# EAGLE design Fritzen_Zero_P_r00 (EAGLE 7.5.0)

## Sheet 1 of 2
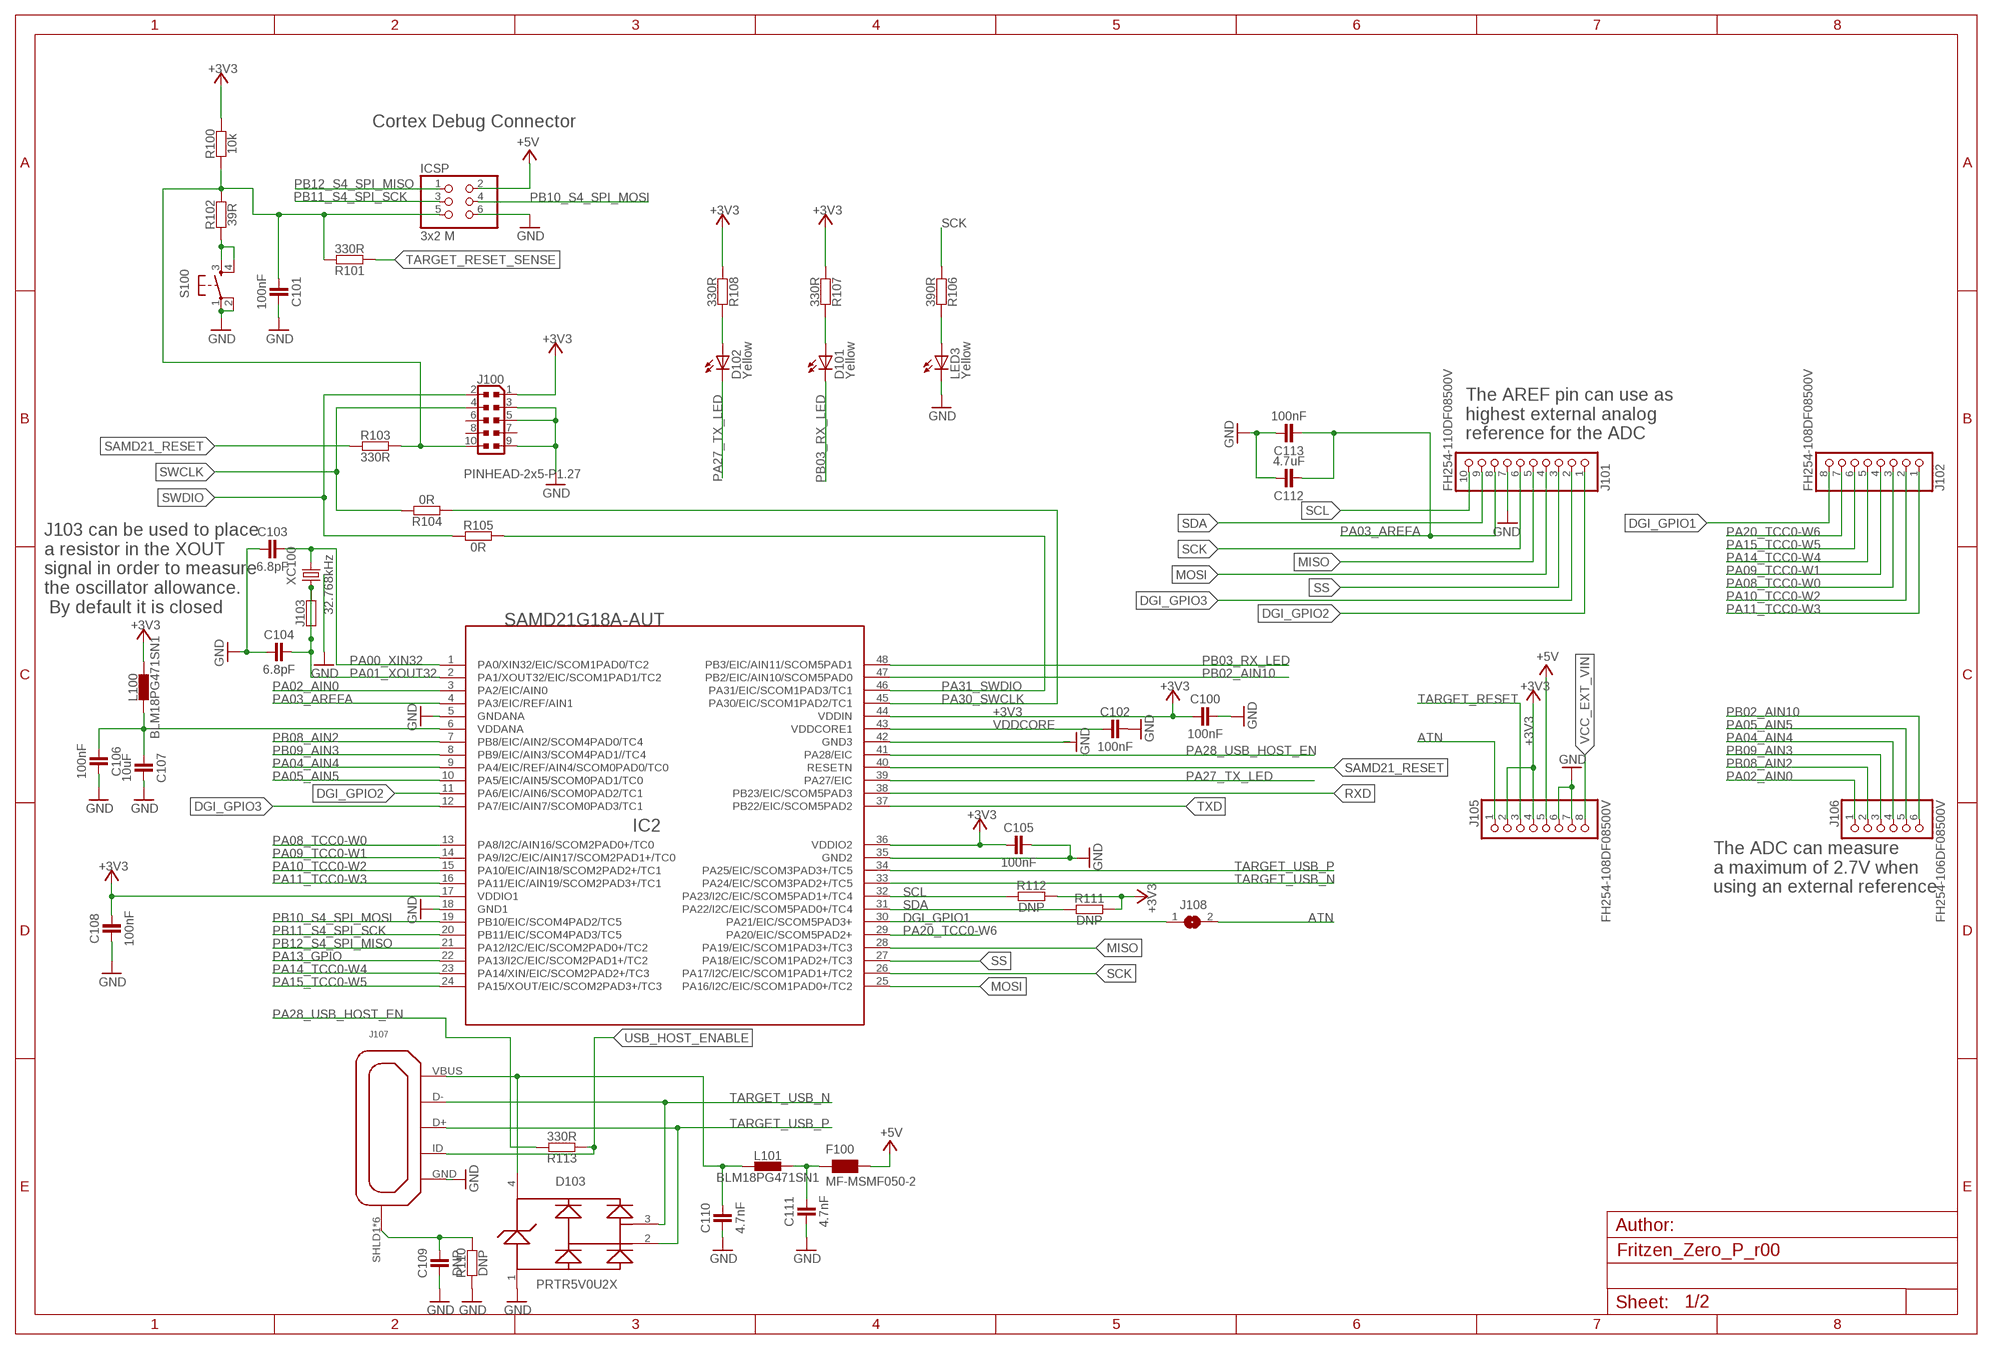
[diagram p0: schematic, sheet 1]

### Parts
C100  100nF  CAPACITORS-0402  [C0402]
C101  100nF  CAPACITORS-0402  [C0402]
C102  100nF  CAPACITORS-0402  [C0402]
C103  6.8pF  CAPACITORS-0402  [C0402]
C104  6.8pF  CAPACITORS-0402  [C0402]
C105  100nF  CAPACITORS-0402  [C0402]
C106  100nF  CAPACITORS-0402  [C0402]
C107  10uF  CAPACITORS-0603  [C0603]
C108  100nF  CAPACITORS-0402  [C0402]
C109  DNP  CAPACITORS-0402  [C0402]
C110  4.7nF  CAPACITORS-0402  [C0402]
C111  4.7nF  CAPACITORS-0402  [C0402]
C112  4.7uF  CAPACITORS-0603  [C0603]
C113  100nF  CAPACITORS-0402  [C0402]
D101  Yellow  0044_KPT-2012YC  [CHIPLED_0805]
D102  Yellow  0044_KPT-2012YC  [CHIPLED_0805]
D103  PRTR5V0U2XB  [SOT143B]
F100  MF-MSMF050-2  WUERTH-ELEKTRONIK_WE-CBF_1812  [WUERTH-ELEKTRONIK_1812]
IC2  SAMD21G18A-AUT  SAMD21G18A  [TQFP48]
ICSP  3x2 M  ICSP  [2X03]
J100  PINHEAD-2x5-P1.27  0171_PH127-205DF055G00AROUND-PADS  [PINHEAD_2X05_127]
J101  FH254-110DF08500V  1684_20TW-537  [1X10]
J102  FH254-108DF08500V  1683_20TW-536  [1X08]
J103  RESISTORS-0402  [C0402]
J105  FH254-108DF08500V  1683_20TW-536  [1X08]
J106  FH254-106DF08500V  1682_20TW-535_STD  [1X06]
J107  ZX62-AB-5PA  [USB-MICRO-10103594]
J108  SJ  [SJ]
L100  BLM18PG471SN1  INDUCTOR-0603  [C0603]
L101  BLM18PG471SN1  INDUCTOR-0603  [C0603]
LED3  Yellow  0044_KPT-2012YC  [CHIPLED_0805]
R100  10k  RESISTORS-0402  [C0402]
R101  330R  RESISTORS-0402  [C0402]
R102  39R  RESISTORS-0402  [C0402]
R103  330R  RESISTORS-0402  [C0402]
R104  0R  RESISTORS-0402  [C0402]
R105  0R  RESISTORS-0402  [C0402]
R106  390R  RESISTORS-0402  [C0402]
R107  330R  RESISTORS-0402  [C0402]
R108  330R  RESISTORS-0402  [C0402]
R110  DNP  RESISTORS-0402  [C0402]
R111  DNP  RESISTORS-0402  [C0402]
R112  DNP  RESISTORS-0402  [C0402]
R113  330R  RESISTORS-0402  [C0402]
S100  PUSHBUTTON3  [TS42_4PINS]
XC100  32.768kHz  CRYSTALSMD  [CRYSTAL_TC26SMD]

### Nets
+3V3: C100.1 C105.1 C108.2 IC2.17(VDDIO1) IC2.36(VDDIO2) IC2.44(VDDIN) J100.1 J105.2 J105.4 L100.2 R100.2 R107.1 R108.1 R111.2 R112.2 ; also sheet 2
+5V [usbvcc]: F100.2 ICSP.2 J105.5 ; also sheet 2
ATN: J105.1 J108.2
DGI_GPIO1: IC2.30(PA21/EIC/SCOM5PAD3+) J102.8 J108.1
DGI_GPIO2: IC2.11(PA6/EIC/AIN6/SCOM0PAD2/TC1) J101.1
DGI_GPIO3: IC2.12(PA7/EIC/AIN7/SCOM0PAD3/TC1) J101.2
GND [gnd]: C100.2 C101.2 C102.2 C103.1 C104.1 C105.2 C106.2 C107.2 C108.1 C109.1 C110.1 C111.1 C112.2 C113.2 D103.1 IC2.5(GNDANA) IC2.18(GND1) IC2.35(GND2) IC2.42(GND3) ICSP.6 J100.3 J100.5 J100.9 J101.7 J105.6 J105.7 J107.GND LED3.C R110.1 S100.1 S100.2 XC100.P$1(GND) ; also sheet 2
MISO: IC2.28(PA19/EIC/SCOM1PAD3+/TC3) J101.5
MOSI: IC2.25(PA16/I2C/EIC/SCOM1PAD0+/TC2) J101.4
N$4: R102.1 S100.3 S100.4
N$7: C110.2 D103.4 J107.VBUS(VUSB) L101.1
N$10: C106.1 C107.1 IC2.6(VDDANA) L100.1
N$11: C109.2 J107.SHLD1(SH) J107.SHLD2(SH) J107.SHLD3(SH) J107.SHLD4(SH) J107.SHLD5(SH) J107.SHLD6(SH) R110.2
N$12: C111.2 F100.1 L101.2
N$20: D102.A R108.2
N$21: D101.A R107.2
N$22: LED3.A R106.2
PA00_XIN32: C103.2 IC2.1(PA0/XIN32/EIC/SCOM1PAD0/TC2) XC100.2
PA01_XOUT32: C104.2 IC2.2(PA1/XOUT32/EIC/SCOM1PAD1/TC2) J103.1 J103.2 XC100.1
PA02_AIN0: IC2.3(PA2/EIC/AIN0) J106.1
PA03_AREFA: C112.1 C113.1 IC2.4(PA3/EIC/REF/AIN1) J101.8
PA04_AIN4: IC2.9(PA4/EIC/REF/AIN4/SCOM0PAD0/TC0) J106.4
PA05_AIN5: IC2.10(PA5/EIC/AIN5/SCOM0PAD1/TC0) J106.5
PA08_TCC0-W0: IC2.13(PA8/I2C/AIN16/SCOM2PAD0+/TC0) J102.3
PA09_TCC0-W1: IC2.14(PA9/I2C/EIC/AIN17/SCOM2PAD1+/TC0) J102.4
PA10_TCC0-W2: IC2.15(PA10/EIC/AIN18/SCOM2PAD2+/TC1) J102.2
PA11_TCC0-W3: IC2.16(PA11/EIC/AIN19/SCOM2PAD3+/TC1) J102.1
PA13_GPIO: IC2.22(PA13/I2C/EIC/SCOM2PAD1+/TC2)
PA14_TCC0-W4: IC2.23(PA14/XIN/EIC/SCOM2PAD2+/TC3) J102.5
PA15_TCC0-W5: IC2.24(PA15/XOUT/EIC/SCOM2PAD3+/TC3) J102.6
PA20_TCC0-W6: IC2.29(PA20/EIC/SCOM5PAD2+) J102.7
PA27_TX_LED: D102.C IC2.39(PA27/EIC)
PA28_USB_HOST_EN: IC2.41(PA28/EIC) R113.2
PA30_SWCLK: IC2.45(PA30/EIC/SCOM1PAD2/TC1) R104.1
PA31_SWDIO: IC2.46(PA31/EIC/SCOM1PAD3/TC1) R105.2
PB02_AIN10: IC2.47(PB2/EIC/AIN10/SCOM5PAD0) J106.6
PB03_RX_LED: D101.C IC2.48(PB3/EIC/AIN11/SCOM5PAD1)
PB08_AIN2: IC2.7(PB8/EIC/AIN2/SCOM4PAD0/TC4) J106.2
PB09_AIN3: IC2.8(PB9/EIC/AIN3/SCOM4PAD1//TC4) J106.3
PB10_S4_SPI_MOSI: IC2.19(PB10/EIC/SCOM4PAD2/TC5) ICSP.4
PB11_S4_SPI_SCK: IC2.20(PB11/EIC/SCOM4PAD3/TC5) ICSP.3
PB12_S4_SPI_MISO: IC2.21(PA12/I2C/EIC/SCOM2PAD0+/TC2) ICSP.1
RXD: IC2.38(PB23/EIC/SCOM5PAD3)
SAMD21_RESET: IC2.40(RESETN) R103.1
SCK: IC2.26(PA17/I2C/EIC/SCOM1PAD1+/TC2) J101.6 R106.1
SCL: IC2.32(PA23/I2C/EIC/SCOM5PAD1+/TC4) J101.10 R112.1
SDA: IC2.31(PA22/I2C/EIC/SCOM5PAD0+/TC4) J101.9 R111.1
SS: IC2.27(PA18/EIC/SCOM1PAD2+/TC3) J101.3
SWCLK: J100.4 R104.2
SWDIO: J100.2 R105.1
TARGET_RESET: C101.1 ICSP.5 J100.10 J105.3 R100.1 R101.2 R102.2 R103.2
TARGET_RESET_SENSE: R101.1
TARGET_USB_N [USBpair]: D103.3 IC2.33(PA24/EIC/SCOM3PAD2+/TC5) J107.D-
TARGET_USB_P [USBpair]: D103.2 IC2.34(PA25/EIC/SCOM3PAD3+/TC5) J107.D+
TXD: IC2.37(PB22/EIC/SCOM5PAD2)
USB_HOST_ENABLE: J107.ID R113.1
VCC_EXT_VIN [USB]: J105.8 ; also sheet 2
VDDCORE: C102.1 IC2.43(VDDCORE1)
Unconnected: J100.6 J100.7 J100.8

### Notes on the sheet
- Cortex Debug Connector
- The AREF pin can use as
  highest external analog
  reference for the ADC
- J103 can be used to place
  a resistor in the XOUT 
  signal in order to measure 
  the oscillator allowance.
   By default it is closed
- The ADC can measure 
  a maximum of 2.7V when
  using an external reference

## Sheet 2 of 2
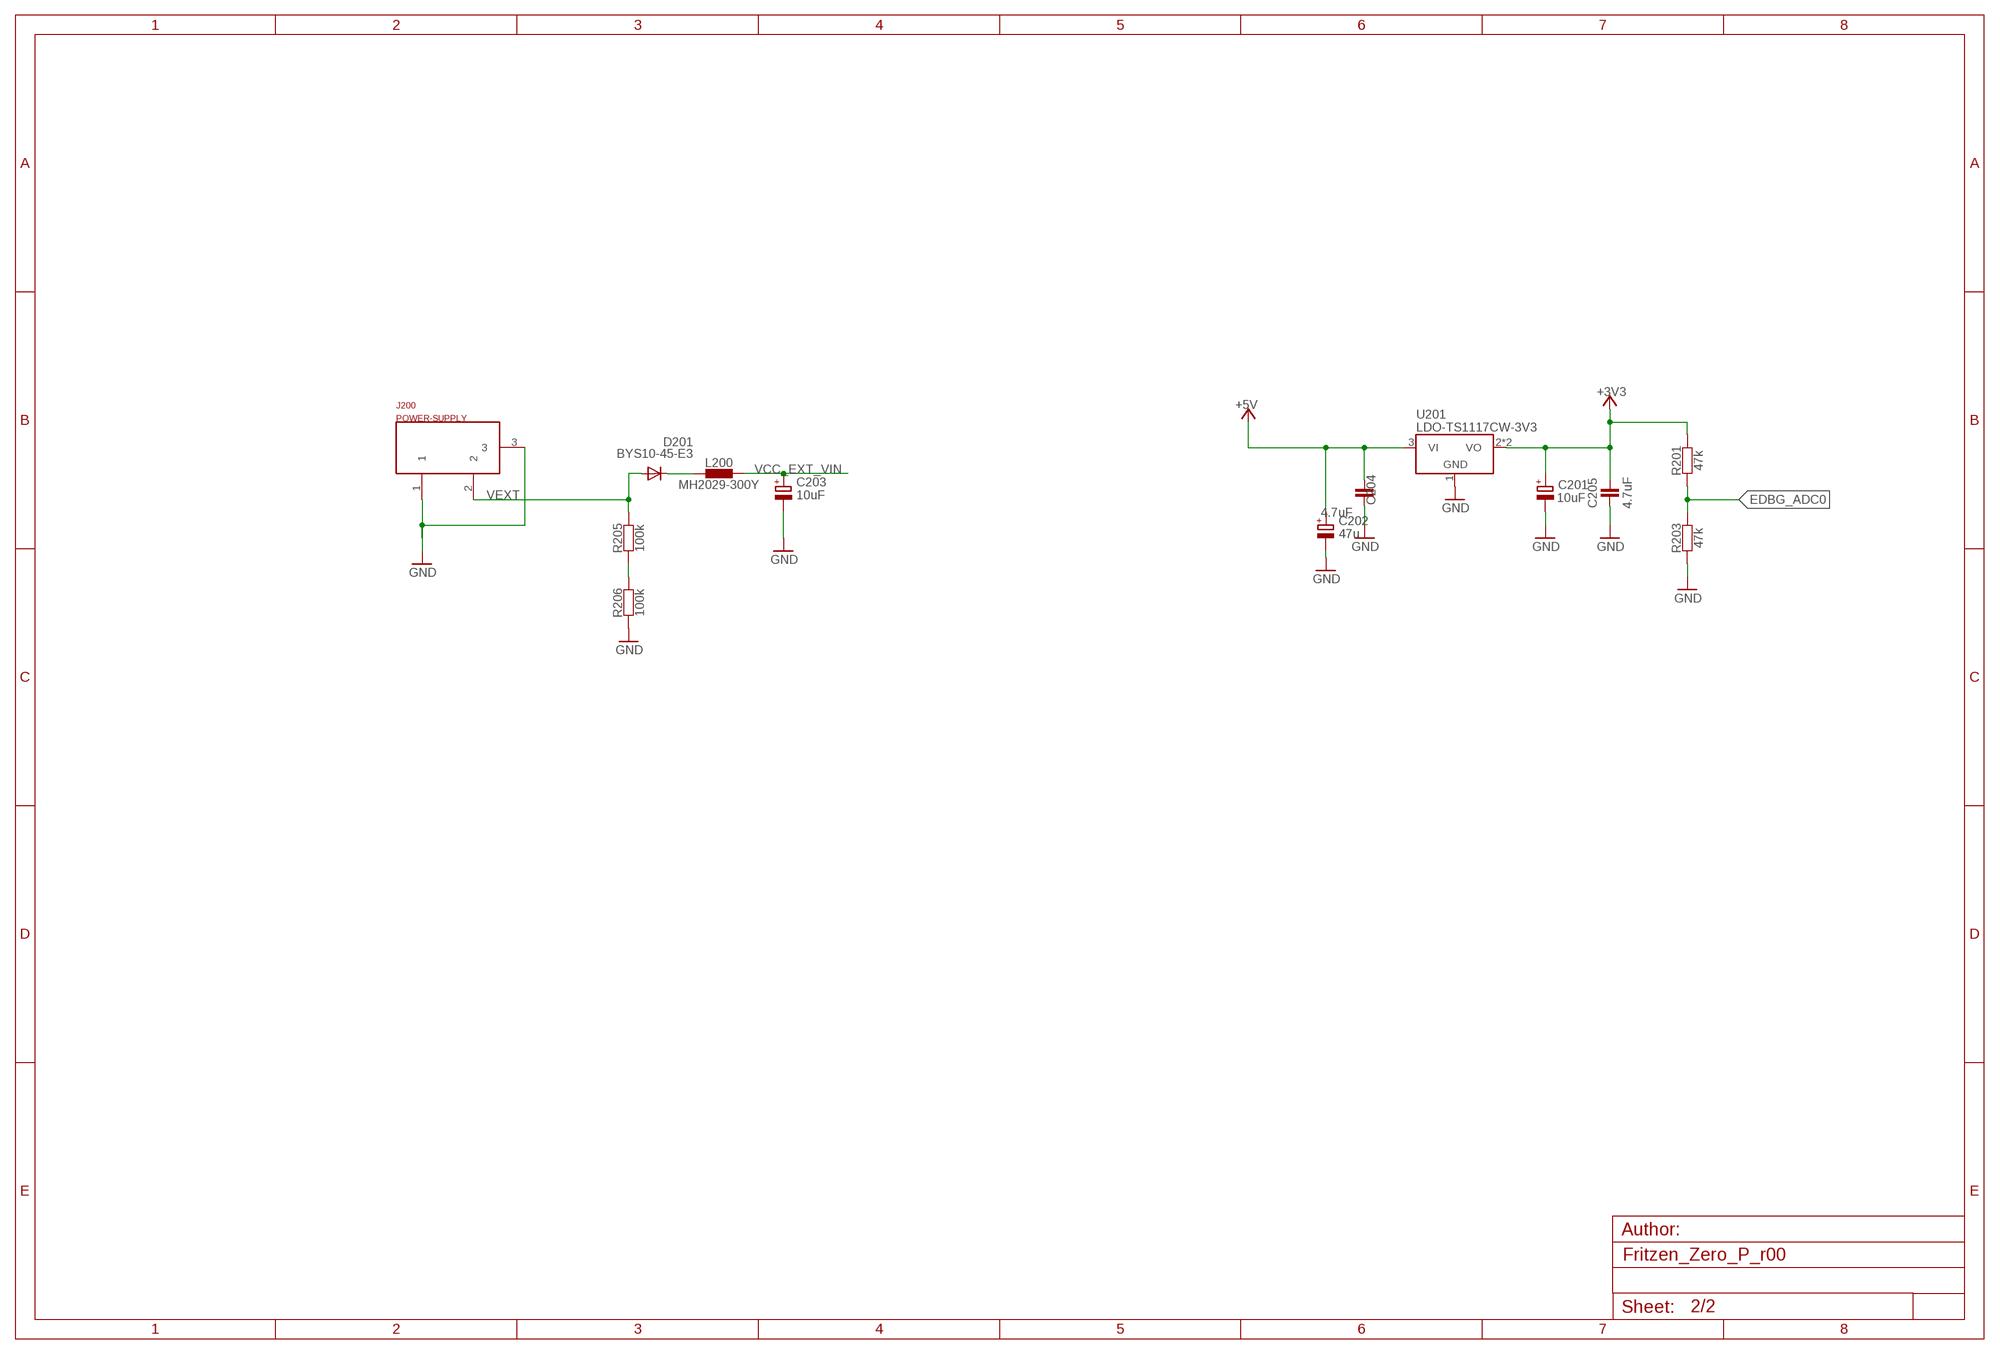
[diagram p1: schematic, sheet 2]

### Parts
C201  10uF  0113_47UF  [PANASONIC_D]
C202  47u  0113_47UF  [PANASONIC_D]
C203  10uF  0113_47UF  [PANASONIC_D]
C204  4.7uF  CAPACITORS-0603  [C0603]
C205  4.7uF  CAPACITORS-0603  [C0603]
D201  BYS10-45-E3  0012_CD1206-S01575  [MINIMELF]
J200  POWER-SUPPLY  0018_19746-POWER-SUPPLY  [POWERSUPPLY_DC-21MM]
L200  MH2029-300Y  INDUCTOR-0805  [C0805]
R201  47k  RESISTORS-0402  [C0402]
R203  47k  RESISTORS-0402  [C0402]
R205  100k  RESISTORS-0402  [C0402]
R206  100k  RESISTORS-0402  [C0402]
U201  LDO-TS1117CW-3V3  [SOT223]

### Nets
+3V3: C201.+ C205.2 R201.2 U201.2(VO) U201.4(VO) ; also sheet 1
+5V [usbvcc]: C202.+ C204.1 U201.3(VI) ; also sheet 1
EDBG_ADC0: R201.1 R203.2
GND [gnd]: C201.- C202.- C203.- C204.2 C205.1 J200.1 J200.3 R203.1 R206.1 U201.1(GND) ; also sheet 1
N$8: D201.C L200.1
VCC_EXT_VIN [USB]: C203.+ L200.2 ; also sheet 1
VEXT [USB]: D201.A J200.2 R205.2
VIN_DETECT: R205.1 R206.2

## Library data of the parts
C100-C113 C204 C205 = Arduino:CAPACITORS: Capacitors ...4.7uF @ 6.3V -> 0402 ...10uF @ 16V -> 0603 ...22uF @ 25V -> 0805
C201-C203 = Condensatori:0113_47UF: 47uF; MONTHLY_USAGE: _____; PART_NUMBER: 47uF; PRICE: _____; SUPPLIER: _____; TYPE: Condensatori; VALUE: 47uF
D101 D102 LED3 = Opto:0044_KPT-2012YC: LED YELLOW - SMD - 0805; MONTHLY_USAGE: _____; PART_NUMBER: KPT-2012YC; PRICE: _____; SUPPLIER: _____; TYPE: Opto
D103 = Arduino:PRTR5V0U2X
D201 = Diodi:0012_CD1206-S01575: small-signal high-speed Switching Diodes CD1206; CASE: 1206; MONTHLY_USAGE: _____; PART_NUMBER: CD1206-S01575; PRICE: _____; SUPPLIER: _____; TYPE: Diodi; VALUE: CD1206-S01575
F100 = Arduino:WUERTH-ELEKTRONIK_WE-CBF: SMD EMI Suppression Ferrite Beads - excellent anti-EMI properties - low DCR - impedances till 3000 ohms - rated current up to 6 A
IC2 = Arduino:SAMD21G18A: Atmel D21 32bit ARM Cortex-M0 microcontroller - 48 PIN TQFP 256KB flash memory + 32KB SRAM
ICSP = Arduino:ICSP: PIN HEADER
J100 = Connettori:0171_PH127-205DF055G00A: 2x5 PASSO 1,27
J101 = Connettori:1684_20TW-537: Female Gray Connector strip for Arduino 3V3 bases - 10x1 F V h 8,5 p2,54mm; MONTHLY_USAGE: _____; PART_NUMBER: 20TW-537; PRICE: _____; SUPPLIER: _____; TYPE: Connettori
J102 J105 = Connettori:1683_20TW-536: Female Gray Connector strip for Arduino 3V3 bases - 8x1 F V h 8,5 p2,54mm; MONTHLY_USAGE: _____; PART_NUMBER: 20TW-536; PRICE: _____; SUPPLIER: _____; TYPE: Connettori
J103 R100-R108 R110-R113 R201 R203 R205 R206 = Arduino:RESISTORS: Resistors all kinds in 0603 and 0402
J106 = Connettori:1682_20TW-535: Female Gray Connector strip for Arduino 3V3 bases - 6x1 F V h 8,5 p2,54; MONTHLY_USAGE: 86722.85; PART_NUMBER: 20TW-535; PRICE: _0.03; SUPPLIER: CBC_elettronica__s.r.l.; TYPE: Connettori
J107 = Arduino:ZX62-AB-5PA
J108 = jumper:SJ: SMD solder JUMPER
J200 = Connettori:0018_19746-POWER-SUPPLY: JACK; MONTHLY_USAGE: _____; PART_NUMBER: 19746; PRICE: _____; SUPPLIER: _____; TYPE: Connettori
L100 L101 L200 = Arduino:INDUCTOR: Inductors
S100 = Arduino:PUSHBUTTON3: TS42 Dongnan Electronics Tact switch VDC 12V - 50mA
U201 = we-power:LDO: LDOs TS1117 800mA max 15V - compatible NCP1117 1A max 20V TS9011 250mA max 12V - compatible AP2210 300mA max 15V TS5204 150mA max 16V
XC100 = Arduino:CRYSTAL: Crystals

## Net classes
0 default: width 0.102 mm, drill 0.1 mm
1 USB: width 0.102 mm, drill 0.1 mm
2 gnd: width 0.102 mm, drill 0.1 mm
3 usbvcc: width 0.102 mm, drill 0.1 mm, clearance 0.15 mm
4 USBpair: width 0.102 mm, drill 0.1 mm, clearance 0.15 mm to class 3

## Board
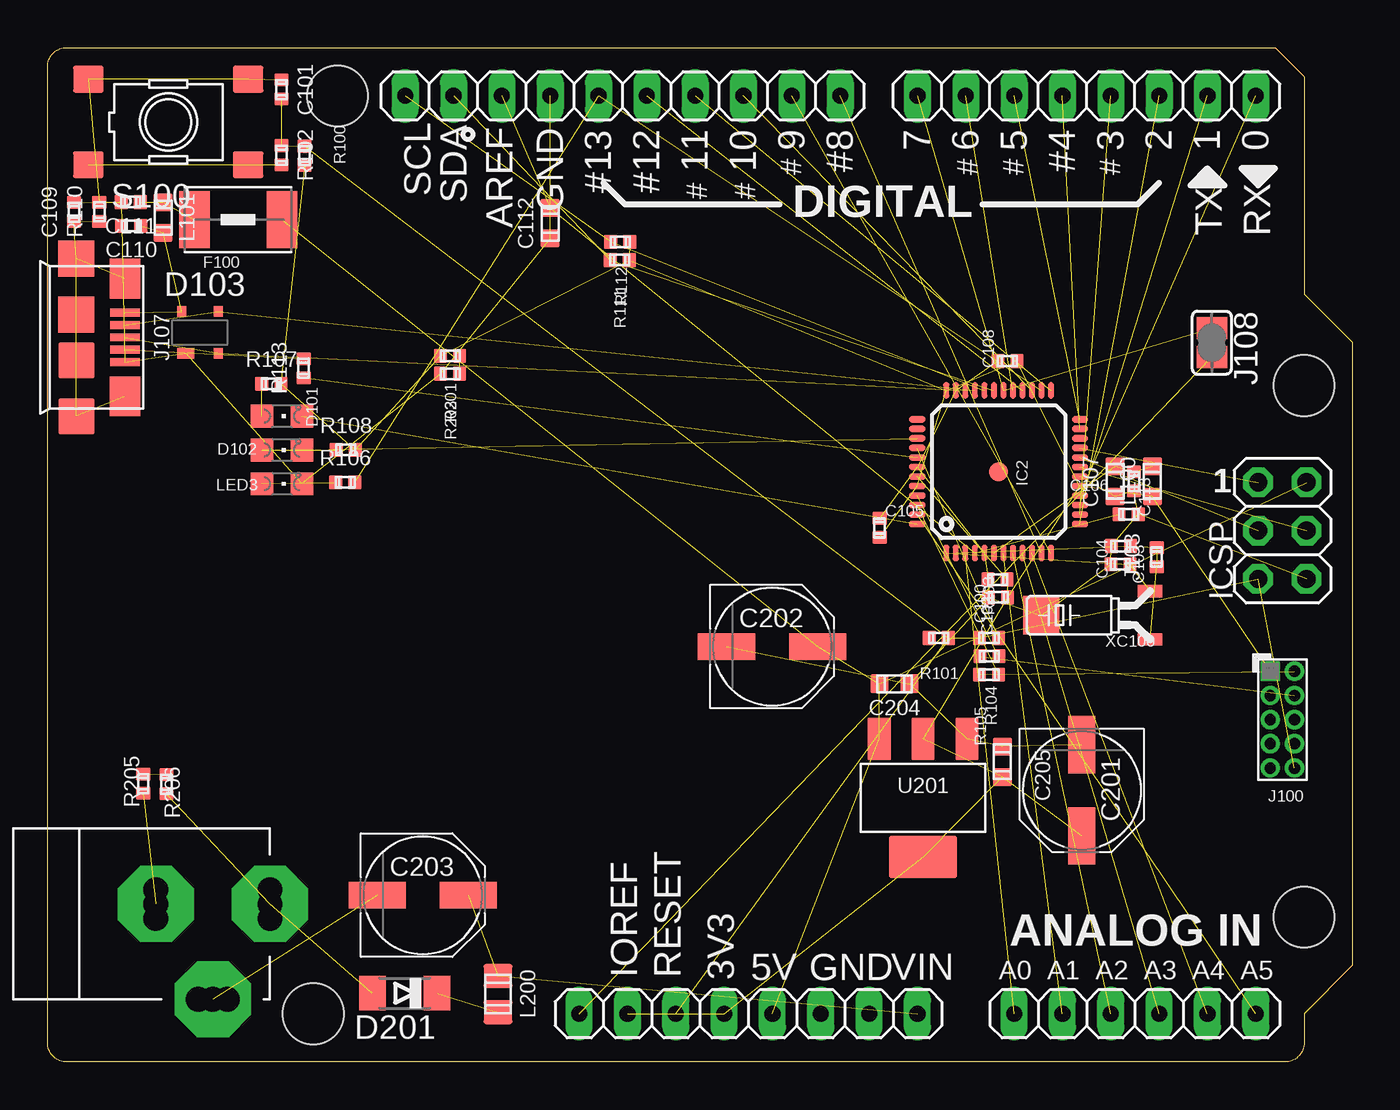
[diagram p2: board, top side]
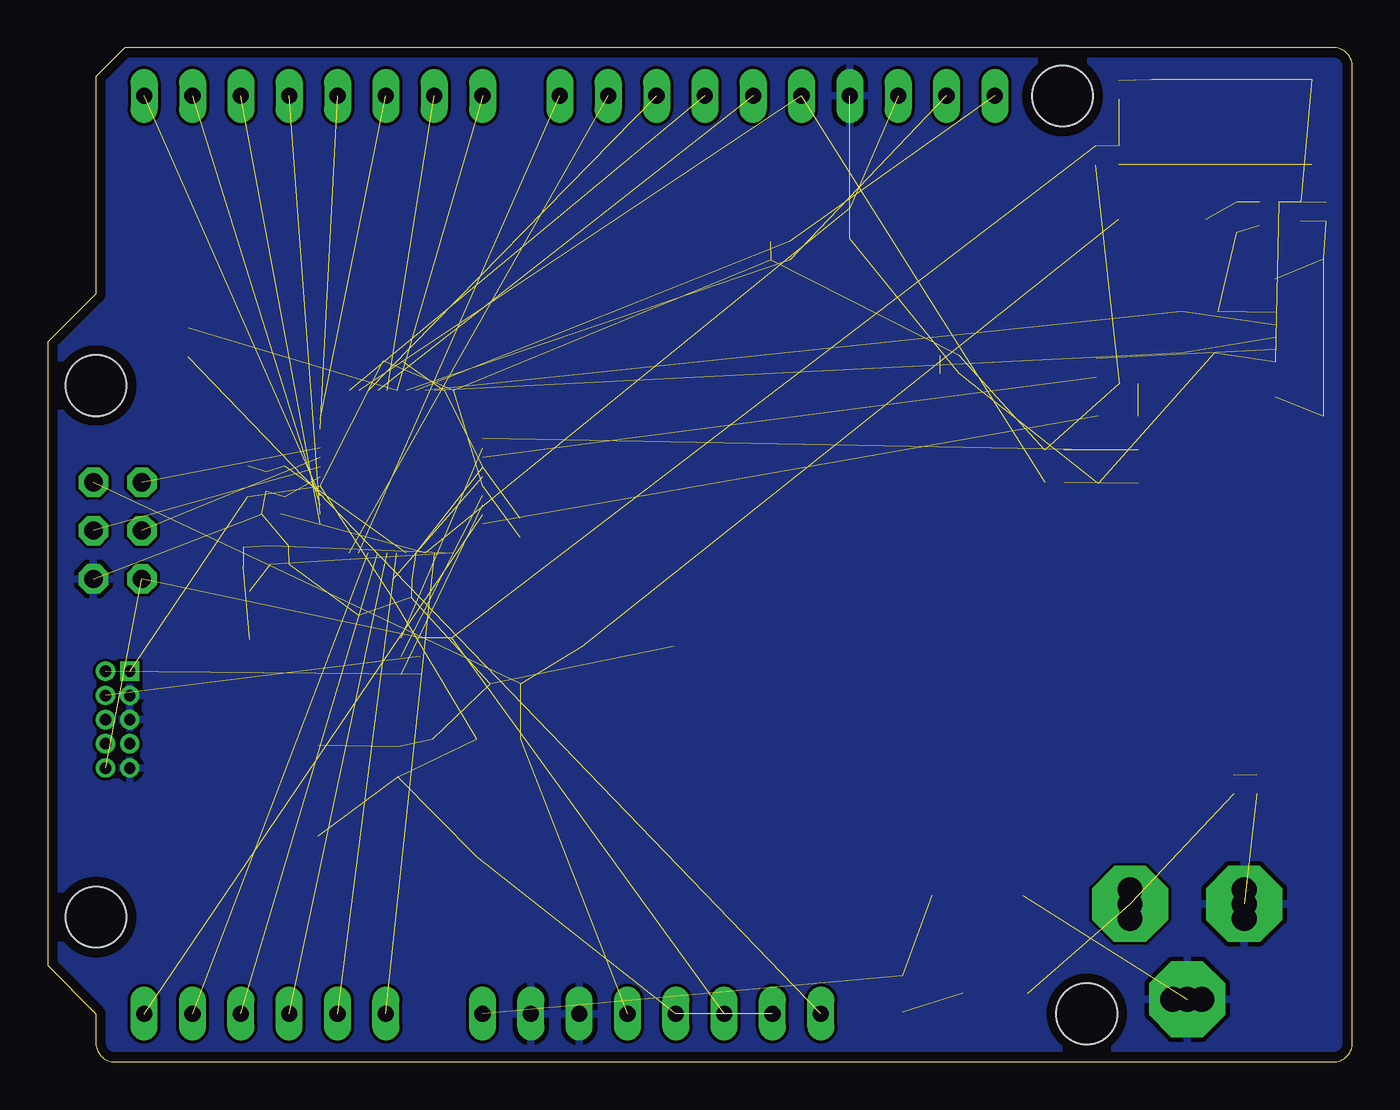
[diagram p3: board, bottom side, seen from below]

Size 68.58 x 53.34 mm. Coordinates in mm from the lower left corner, seen from the top.
Outline: 64.52,53.34 66.04,51.82 66.04,40.39 68.58,37.85 68.58,5.08 66.04,2.54 66.04,1 arc-90 65.04,0 1,0 arc-90 0,1 0,52.34 arc-90 1,53.34 64.52,53.34
Copper layers (1*16): Top 0.035mm / dielectric 1.6mm / Bottom 0.035mm
Design rules "Elecrow_2-layer_PCB_eagle_rule": minimum track width 6mil, minimum drill 12mil, track to track 6mil, track to pad 6mil, pad to pad 6mil, via to via 8mil, smd to smd 0mil, copper to edge 20mil, drill to drill 10mil, minimum pad ring 6mil, minimum via ring 6mil, stop-mask expansion 0mil, vias tented up to drill 100mil, thermal gap 10mil
Holes 3.2 mm at 66.04,35.56 66.04,7.62 15.24,50.8 13.97,2.54

### Footprints (pad centres in the part's own frame; a part is rotated, then mirrored left to right if it is on the bottom)
C0402 = smd 0.75 x 0.7: 1 0,0.5; 2 0,-0.5
C0603 = smd 1 x 0.95: 1 0,0.8; 2 0,-0.8
PANASONIC_D = smd 3 x 1.4: + 2.4,0; - -2.4,0
CHIPLED_0805 = smd 1.2 x 1.2: A 0,-1.05; C 0,1.05
SOT143B = smd 0.88 x 0.55: 1 -0.75,-1.1 | smd 0.48 x 0.55: 2 0.95,-1.1; 3 0.95,1.1; 4 -0.95,1.1
MINIMELF = smd 1.4 x 1.8: A 1.7,0; C -1.7,0
WUERTH-ELEKTRONIK_1812 = smd 1.6 x 3: 1 -2.3,0; 2 2.3,0
TQFP48 = smd 0.85 x 0.32: 1 -4.275,2.75; 2 -4.275,2.25; 3 -4.275,1.75; 4 -4.275,1.25; 5 -4.275,0.75; 6 -4.275,0.25; 7 -4.275,-0.25; 8 -4.275,-0.75; 9 -4.275,-1.25; 10 -4.275,-1.75; 11 -4.275,-2.25; 12 -4.275,-2.75; 25 4.275,-2.75; 26 4.275,-2.25; 27 4.275,-1.75; 28 4.275,-1.25; 29 4.275,-0.75; 30 4.275,-0.25; 31 4.275,0.25; 32 4.275,0.75; 33 4.275,1.25; 34 4.275,1.75; 35 4.275,2.25; 36 4.275,2.75 | smd 0.32 x 0.85: 13 -2.75,-4.275; 14 -2.25,-4.275; 15 -1.75,-4.275; 16 -1.25,-4.275; 17 -0.75,-4.275; 18 -0.25,-4.275; 19 0.25,-4.275; 20 0.75,-4.275; 21 1.25,-4.275; 22 1.75,-4.275; 23 2.25,-4.275; 24 2.75,-4.275; 37 2.75,4.275; 38 2.25,4.275; 39 1.75,4.275; 40 1.25,4.275; 41 0.75,4.275; 42 0.25,4.275; 43 -0.25,4.275; 44 -0.75,4.275; 45 -1.25,4.275; 46 -1.75,4.275; 47 -2.25,4.275; 48 -2.75,4.275 | smd 1 x 1: P$1 0,0
2X03 = drill 0.95 pad 1.55 octagon: 1 -2.54,-1.27; 2 -2.54,1.27; 3 0,-1.27; 4 0,1.27; 5 2.54,-1.27; 6 2.54,1.27
PINHEAD_2X05_127 = drill 0.6 pad 1.016 square: 1 -0.635,2.54 | drill 0.6 pad 1.016: 2 0.635,2.54; 3 -0.635,1.27; 4 0.635,1.27; 5 -0.635,0; 6 0.635,0; 7 -0.635,-1.27; 8 0.635,-1.27; 9 -0.635,-2.54; 10 0.635,-2.54
1X10 = drill 0.85 pad 1.422 long: 1 -11.43,0; 2 -8.89,0; 3 -6.35,0; 4 -3.81,0; 5 -1.27,0; 6 1.27,0; 7 3.81,0; 8 6.35,0; 9 8.89,0; 10 11.43,0
1X08 = drill 0.85 pad 1.422 long: 1 -8.89,0; 2 -6.35,0; 3 -3.81,0; 4 -1.27,0; 5 1.27,0; 6 3.81,0; 7 6.35,0; 8 8.89,0
1X06 = drill 0.85 pad 1.422 long: 1 -6.35,0; 2 -3.81,0; 3 -1.27,0; 4 1.27,0; 5 3.81,0; 6 6.35,0
USB-MICRO-10103594 = smd 0.4 x 1.6: D+ 0,0; D- -0.65,0; GND 1.3,0; ID 0.65,0; VBUS -1.3,0 | smd 1.9 x 1.9: SHLD1 -1.2,-2.55; SHLD2 1.2,-2.55; SHLD3 -4.15,-2.55; SHLD4 4.15,-2.55 | smd 2.1 x 1.6: SHLD5 3.1,0; SHLD6 -3.1,0
SJ = smd 1.168 x 1.6: 1 -0.762,0; 2 0.762,0
POWERSUPPLY_DC-21MM = drill 1.3 pad 4 octagon: 1 -5.08,-3.353; 2 -0.076,-6.35; 3 -0.076,-0.356 | drill 1.3: 4 -5.08,-4.115; 5 -5.08,-2.591; 6 -0.838,-0.356; 7 0.686,-0.356; 8 -0.838,-6.35; 9 0.686,-6.35
C0805 = smd 1.5 x 1.25: 1 0,0.95; 2 0,-0.95
TS42_4PINS = smd 1.6 x 1.4: 1 -4.2,2.25; 2 4.2,2.25; 3 -4.2,-2.25; 4 4.2,-2.25
SOT223 = smd 2.235 x 1.219: 1 -3.099,2.311; 2 -3.099,0; 3 -3.099,-2.311 | smd 2.2 x 3.6: 4 3.099,0
CRYSTAL_TC26SMD = smd 1.27 x 0.635: 1 0,1.27; 2 0,-1.27 | smd 1.905 x 2.032: P$1 5.715,0

### Placement (x,y rotation side)
C100  49.96,24.43 270 top
C101  12.29,51.13 180 top
C102  49.93,25.37 270 top
C103  56.39,26.16 90 top
C104  56.41,27.13 90 top
C105  43.74,28.08 180 top
C106  57.1,30.53 0 top
C107  56.11,30.53 0 top
C108  50.44,36.85 90 top
C109  1.38,44.7 0 top
C110  4.39,43.97 90 top
C111  4.37,45.21 90 top
C112  26.42,44.1 0 top
C113  56.82,28.8 90 top
C201  54.36,14.28 270 top
C202  38.08,21.84 0 top
C203  19.72,8.77 0 top
C204  44.51,19.88 90 top
C205  50.18,15.79 0 top
D101  12.32,33.96 270 top
D102  12.32,32.18 270 top
D103  8.01,38.37 0 top
D201  18.77,3.62 180 top
F100  10.01,44.29 0 top
IC2  49.99,31.04 90 top
ICSP  64.9,27.94 270 top
J100  64.9,18 0 top
J101  30.23,50.8 180 top
J102  54.61,50.8 180 top
J103  58.29,26.54 0 top
J105  36.83,2.54 0 top
J106  57.15,2.54 0 top
J107  4.06,38.1 270 top
J108  61.19,37.82 270 top
J200  5.33,8.38 90 top
L100  58.06,30.53 0 top
L101  6.07,44.4 180 top
L200  23.67,3.57 180 top
LED3  12.32,30.4 270 top
R100  13.51,47.65 0 top
R101  46.84,22.3 90 top
R102  12.29,47.68 180 top
R103  49.48,22.3 270 top
R104  49.5,21.33 270 top
R105  49.48,20.37 90 top
R106  15.64,30.48 270 top
R107  11.76,35.66 270 top
R108  15.67,32.18 270 top
R110  2.72,44.7 0 top
R111  30.07,42.16 90 top
R112  30.1,43.13 90 top
R113  13.46,36.47 0 top
R201  21.16,37.13 270 top
R203  21.16,36.2 90 top
R205  6.25,14.6 0 top
R206  5.03,14.63 180 top
S100  6.34,49.42 0 top
U201  46.01,13.89 270 top
XC100  57.94,23.48 180 top

### Tracks (layer width: path | path; a pad name or v marks a point on that pad's centre or on a via)
+3V3  (19 unrouted)
+5V  (5 unrouted)
ATN  (1 unrouted)
DGI_GPIO1  (2 unrouted)
DGI_GPIO2  (1 unrouted)
DGI_GPIO3  (1 unrouted)
EDBG_ADC0  (1 unrouted)
GND  (33 unrouted)
  pour Bottom: -0.38,-0.13 68.61,-0.13 68.61,53.31 -0.38,53.31
MISO  (1 unrouted)
MOSI  (1 unrouted)
N$4  (2 unrouted)
N$7  (3 unrouted)
N$8  (1 unrouted)
N$10  (3 unrouted)
N$11  (7 unrouted)
N$12  (2 unrouted)
N$20  (1 unrouted)
N$21  (1 unrouted)
N$22  (1 unrouted)
PA00_XIN32  (2 unrouted)
PA01_XOUT32  (4 unrouted)
PA02_AIN0  (1 unrouted)
PA03_AREFA  (3 unrouted)
PA04_AIN4  (1 unrouted)
PA05_AIN5  (1 unrouted)
PA08_TCC0-W0  (1 unrouted)
PA09_TCC0-W1  (1 unrouted)
PA10_TCC0-W2  (1 unrouted)
PA11_TCC0-W3  (1 unrouted)
PA14_TCC0-W4  (1 unrouted)
PA15_TCC0-W5  (1 unrouted)
PA20_TCC0-W6  (1 unrouted)
PA27_TX_LED  (1 unrouted)
PA28_USB_HOST_EN  (1 unrouted)
PA30_SWCLK  (1 unrouted)
PA31_SWDIO  (1 unrouted)
PB02_AIN10  (1 unrouted)
PB03_RX_LED  (1 unrouted)
PB08_AIN2  (1 unrouted)
PB09_AIN3  (1 unrouted)
PB10_S4_SPI_MOSI  (1 unrouted)
PB11_S4_SPI_SCK  (1 unrouted)
PB12_S4_SPI_MISO  (1 unrouted)
SAMD21_RESET  (1 unrouted)
SCK  (2 unrouted)
SCL  (2 unrouted)
SDA  (2 unrouted)
SS  (1 unrouted)
SWCLK  (1 unrouted)
SWDIO  (1 unrouted)
TARGET_RESET  (7 unrouted)
TARGET_USB_N  (2 unrouted)
TARGET_USB_P  (2 unrouted)
USB_HOST_ENABLE  (1 unrouted)
VCC_EXT_VIN  (2 unrouted)
VDDCORE  (1 unrouted)
VEXT  (2 unrouted)
VIN_DETECT  (1 unrouted)

### Text on the board
tPlace: #13 | #12 | 11 | 10 | 9 | #8 | 7 | 6 | 5 | #4 | 3 | 2 | 1 | 0
tNames: SCL | SDA | AREF | GND | # | # | # | # | # | # | DIGITAL | TX | RX | 1 | ANALOG IN | IOREF | RESET | 3V3 | 5V | GND | VIN | A0 | A1 | A2 | A3 | A4 | A5
214bmp: D:/SmartProjects/Snc/a4_bn_logo2.bmp